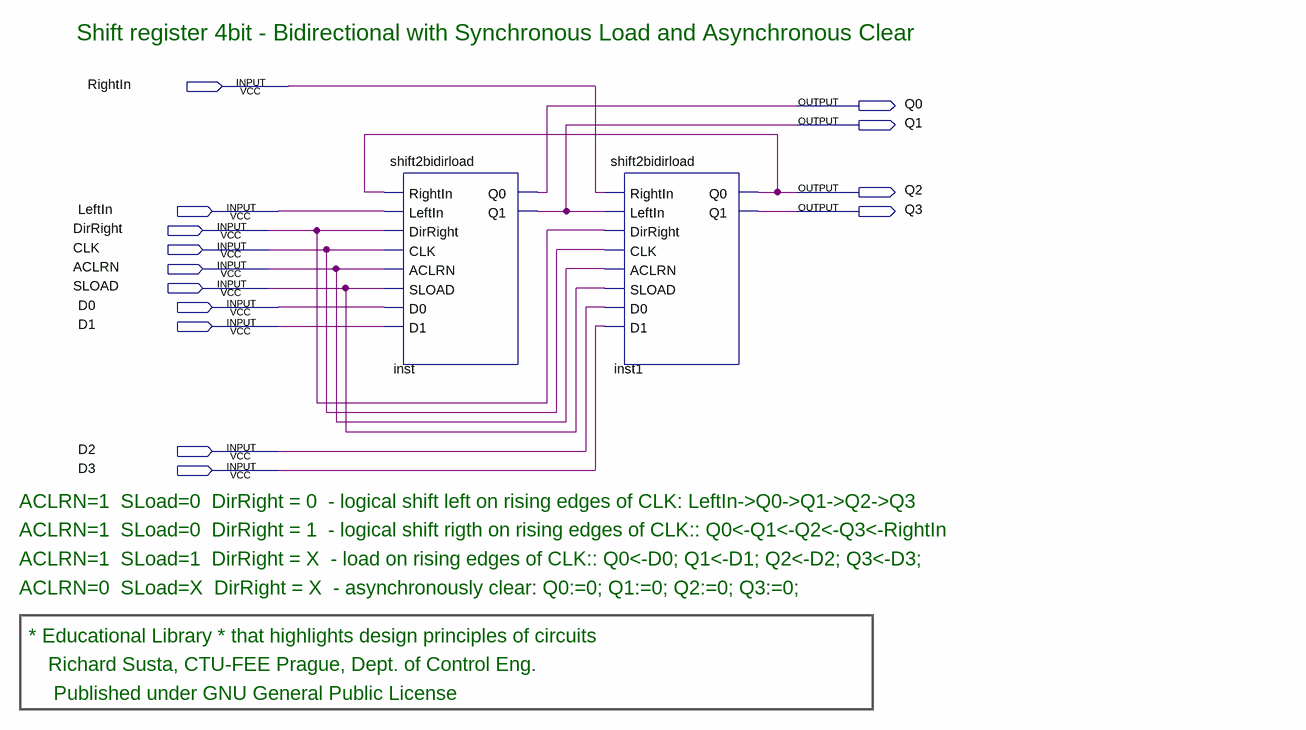
[diagram p0: schematic sheet]
// Quartus schematic shift4bidirload.bdf as structural Verilog: 2 symbols, 14 pins
module shift4bidirload (
  input  RightIn,
  input  LeftIn,
  input  DirRight,
  input  CLK,
  input  ACLRN,
  input  SLOAD,
  input  D0,
  input  D1,
  input  D2,
  input  D3,
  output Q0,
  output Q1,
  output Q2,
  output Q3
);

  shift2bidirload inst (
    .RightIn(Q2), .LeftIn(LeftIn), .DirRight(DirRight), .CLK(CLK), .ACLRN(ACLRN), .SLOAD(SLOAD), .D0(D0),
    .D1(D1), .Q0(Q0), .Q1(Q1));
  shift2bidirload inst1 (
    .RightIn(RightIn), .LeftIn(Q1), .DirRight(DirRight), .CLK(CLK), .ACLRN(ACLRN), .SLOAD(SLOAD), .D0(D2),
    .D1(D3), .Q0(Q2), .Q1(Q3));

  // Notes on the sheet:
  //   Shift register 4bit - Bidirectional with Synchronous Load and Asynchronous Clear
  //   ACLRN=1  SLoad=0  DirRight = 0  - logical shift left on rising edges of CLK: LeftIn->Q0->Q1->Q2->Q3
  //   ACLRN=1  SLoad=0  DirRight = 1  - logical shift rigth on rising edges of CLK:: Q0<-Q1<-Q2<-Q3<-RightIn
  //   ACLRN=1  SLoad=1  DirRight = X  - load on rising edges of CLK:: Q0<-D0; Q1<-D1; Q2<-D2; Q3<-D3;
  //   ACLRN=0  SLoad=X  DirRight = X  - asynchronously clear: Q0:=0; Q1:=0; Q2:=0; Q3:=0;
  //   * Educational Library * that highlights design principles of circuits
  //   Richard Susta, CTU-FEE Prague, Dept. of Control Eng. 
  //    Published under GNU General Public License
endmodule
